# EAGLE design zero_board (EAGLE 9.6.2)
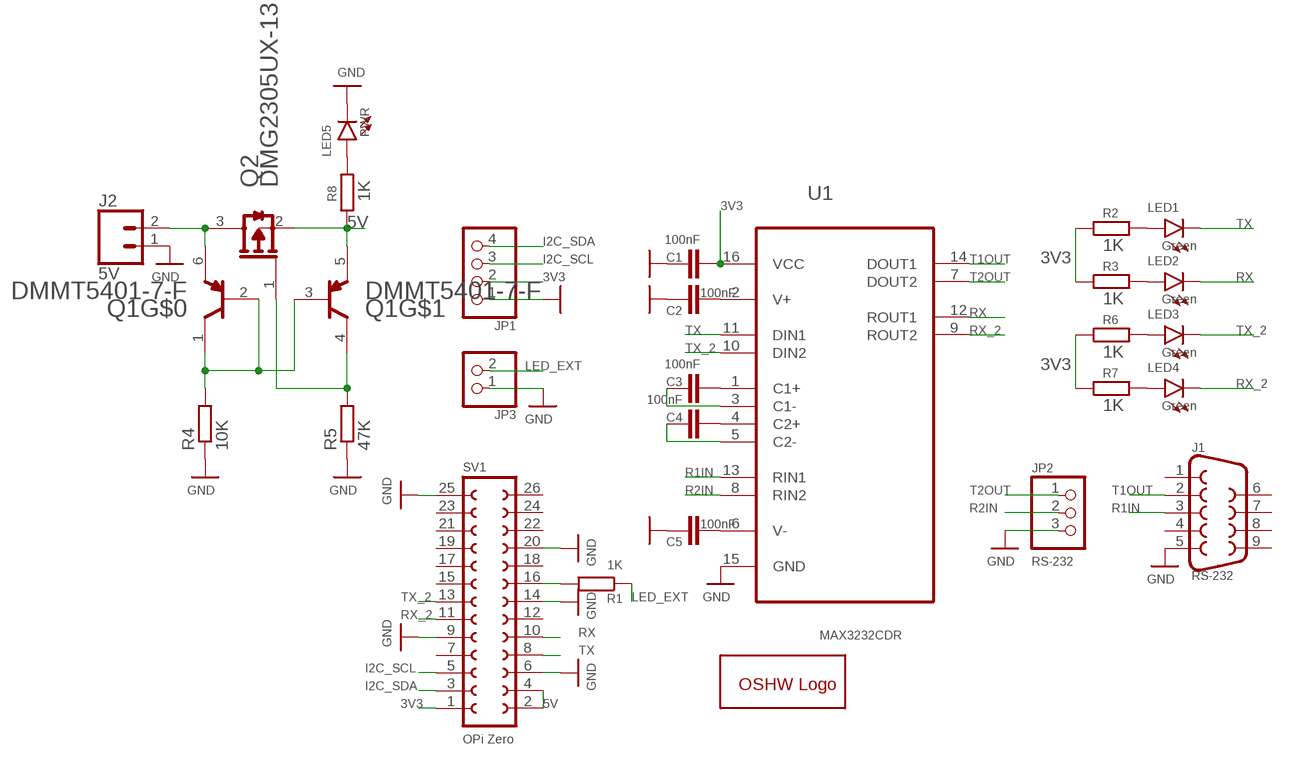
[diagram p0: schematic, sheet 1]

## Parts
C1  100nF  C-EUC0603  [C0603]
C2  100nF  C-EUC0603  [C0603]
C3  100nF  C-EUC0603  [C0603]
C4  100nF  C-EUC0603  [C0603]
C5  100nF  C-EUC0603  [C0603]
GOLD_ORB_SM1  OSHWLOGOLOGO5MM  [OSHW_5MM]
J1  RS-232  DB9FEMALE  [DB9]
J2  5V  CONN_023.5MM  [SCREWTERMINAL-3.5MM-2]
JP1  OLED  PINHD-1X4  [1X04]
JP2  RS-232  PINHD-1X3  [1X03]
JP3  LED  PINHD-1X2  [1X02]
LED1  Green  LEDCHIP-LED0603  [CHIP-LED0603]
LED2  Green  LEDCHIP-LED0603  [CHIP-LED0603]
LED3  Green  LEDCHIP-LED0603  [CHIP-LED0603]
LED4  Green  LEDCHIP-LED0603  [CHIP-LED0603]
LED5  PWR  LEDCHIP-LED0603  [CHIP-LED0603]
Q1  DIODES_DMMT5401-7-FDIODES_DMMT5401-7-F_0_0  [DIODES_DMMT5401-7-F_0]
Q2  DIODES_INC._DMG2305UX-13DIODES_INC._DMG2305UX-13_0_0  [DIODES_INC._DMG2305UX-13_0]
R1  1K  R-EU_R0603  [R0603]
R2  1K  R-EU_R0603  [R0603]
R3  1K  R-EU_R0603  [R0603]
R4  10K  R-EU_R0402  [R0402]
R5  47K  R-EU_R0402  [R0402]
R6  1K  R-EU_R0603  [R0603]
R7  1K  R-EU_R0603  [R0603]
R8  1K  R-EU_R0603  [R0603]
SV1  OPi Zero  FE13-2  [FE13-2]
U1  MAX3232CDR  [SOIC127P600X175-16N]

## Nets
3V3: C1.2 JP1.2 R2.1 R3.1 R6.1 R7.1 SV1.1 U1.16(VCC)
5V: Q1.5(E2) Q2.2(S) R8.1 SV1.2 SV1.4
GND: C1.1 C2.1 C5.1 J1.5 J2.1 JP1.1 JP2.3 JP3.1 LED5.C R4.1 R5.1 SV1.6 SV1.9 SV1.14 SV1.20 SV1.25 U1.15(GND)
I2C_SCL: JP1.3 SV1.5
I2C_SDA: JP1.4 SV1.3
LED_EXT: JP3.2 R1.1
N$1: C4.1 U1.5(C2-)
N$2: C2.2 U1.2(V+)
N$3: C3.1 U1.3(C1-)
N$4: R1.2 SV1.16
N$5: C3.2 U1.1(C1+)
N$6: C4.2 U1.4(C2+)
N$7: C5.2 U1.6(V-)
N$8: LED1.A R2.2
N$9: LED2.A R3.2
N$10: Q1.1(C1) Q1.2(B1) Q1.3(B2) R4.2
N$11: J2.2 Q1.6(E1) Q2.3(D)
N$12: Q1.4(C2) Q2.1(G) R5.2
N$13: LED3.A R6.2
N$14: LED4.A R7.2
N$15: LED5.A R8.2
R1IN: J1.3 U1.13(RIN1)
R2IN: JP2.2 U1.8(RIN2)
RX: LED2.C SV1.10 U1.12(ROUT1)
RX_2: LED4.C SV1.11 U1.9(ROUT2)
T1OUT: J1.2 U1.14(DOUT1)
T2OUT: JP2.1 U1.7(DOUT2)
TX: LED1.C SV1.8 U1.11(DIN1)
TX_2: LED3.C SV1.13 U1.10(DIN2)
Unconnected: J1.1 J1.4 J1.6 J1.7 J1.8 J1.9 SV1.7 SV1.12 SV1.15 SV1.17 SV1.18 SV1.19 SV1.21 SV1.22 SV1.23 SV1.24 SV1.26

## Library data of the parts
C1-C5 = rcl:C-EU: CAPACITOR, European symbol; SPICEPREFIX: C
GOLD_ORB_SM1 = oshw:OSHWLOGO: The OSHW logo for PCB layout
J1 = SparkFun-Connectors:DB9: DB9 Connector Standard DB9 (D-Sub 9) serial connector. Can be used for CAN bus as well as RS485 and RS232. Footprint production proven. Here is the female version connector we sell at SparkFun: 9 Pin Female Serial Connector - PCB Mount <https://www.sparkfun.com/products/429> (PRT-00429) This connector has been used on the following SparkFun products: SparkFun RS232 Shifter - SMD <https://www.sparkfun.com/products/449> (PRT-00449) SparkFun RS232 Shifter SMD (No DB9) <https://www.sparkfun.com/products/8780> (PRT-08780); PROD_ID: CONN-08194
J2 = SparkFun-Connectors:CONN_02: Multi connection point. Often used as Generic Header-pin footprint for 0.1 inch spaced/style header connections On any of the 0.1 inch spaced packages, you can populate with these: Break Away Headers - Straight <https://www.sparkfun.com/products/116> (PRT-00116) Break Away Male Headers - Right Angle <https://www.sparkfun.com/products/553> (PRT-00553) Female Headers <https://www.sparkfun.com/products/115> (PRT-00115) Break Away Headers - Machine Pin <https://www.sparkfun.com/products/117> (PRT-00117) Break Away Female Headers - Swiss Machine Pin <https://www.sparkfun.com/products/743> (PRT-00743) For SCREWTERMINALS and SPRING TERMINALS visit here: Screw Terimnals on SparkFun.com <https://www.sparkfun.com/search/results?term=Screw+Terminals> (5mm/3.5mm/2.54mm spacing) This device is also useful as a general connection point to wire up your design to another part of your project. Our various solder wires solder well into these plated through hole pads. Hook-Up Wire - Assortment (Stranded, 22 AWG) <https://www.sparkfun.com/products/11375> (PRT-11375) Hook-Up Wire - Assortment (Solid Core, 22 AWG) <https://www.sparkfun.com/products/11367> (PRT-11367) View the entire wire category on our website here <https://www.sparkfun.com/categories/141> Special notes: Molex polarized connector foot print use with: PRT-08233 with associated crimp pins and housings. 2.54_SCREWTERM for use with PRT-10571. 3.5mm Screw Terminal footprints for PRT-08084 5mm Screw Terminal footprints for use with PRT-08432; PROD_ID: CONN-08399
JP1 = pinhead:PINHD-1X4: PIN HEADER
JP2 = pinhead:PINHD-1X3: PIN HEADER
JP3 = pinhead:PINHD-1X2: PIN HEADER
LED1-LED5 = led:LED: LED OSRAM: - CHIPLED LG R971, LG N971, LY N971, LG Q971, LY Q971, LO R971, LY R971 LH N974, LH R974 LS Q976, LO Q976, LY Q976 LO Q996 - Hyper CHIPLED LW Q18S LB Q993, LB Q99A, LB R99A - SideLED LS A670, LO A670, LY A670, LG A670, LP A670 LB A673, LV A673, LT A673, LW A673 LH A674 LY A675 LS A676, LA A676, LO A676, LY A676, LW A676 LS A679, LY A679, LG A679 - Hyper Micro SIDELED® LS Y876, LA Y876, LO Y876, LY Y876 LT Y87S - SmartLED LW L88C, LW L88S LB L89C, LB L89S, LG L890 LS L89K, LO L89K, LY L89K LS L896, LA L896, LO L896, LY L896 - TOPLED LS T670, LO T670, LY T670, LG T670, LP T670 LSG T670, LSP T670, LSY T670, LOP T670, LYG T670 LG T671, LOG T671, LSG T671 LB T673, LV T673, LT T673, LW T673 LH T674 LS T676, LA T676, LO T676, LY T676, LB T676, LH T676, LSB T676, LW T676 LB T67C, LV T67C, LT T67C, LS T67K, LO T67K, LY T67K, LW E67C LS E67B, LA E67B, LO E67B, LY E67B, LB E67C, LV E67C, LT E67C LW T67C LS T679, LY T679, LG T679 LS T770, LO T770, LY T770, LG T770, LP T770 LB T773, LV T773, LT T773, LW T773 LH T774 LS E675, LA E675, LY E675, LS T675 LS T776, LA T776, LO T776, LY T776, LB T776 LHGB T686 LT T68C, LB T68C - Hyper Mini TOPLED® LB M676 - Mini TOPLED Santana® LG M470 LS M47K, LO M47K, LY M47K Source: http://www.osram.convergy.de LUXEON: - LUMILED® LXK2-PW12-R00, LXK2-PW12-S00, LXK2-PW14-U00, LXK2-PW14-V00 LXK2-PM12-R00, LXK2-PM12-S00, LXK2-PM14-U00 LXK2-PE12-Q00, LXK2-PE12-R00, LXK2-PE12-S00, LXK2-PE14-T00, LXK2-PE14-U00 LXK2-PB12-K00, LXK2-PB12-L00, LXK2-PB12-M00, LXK2-PB14-N00, LXK2-PB14-P00, LXK2-PB14-Q00 LXK2-PR12-L00, LXK2-PR12-M00, LXK2-PR14-Q00, LXK2-PR14-R00 LXK2-PD12-Q00, LXK2-PD12-R00, LXK2-PD12-S00 LXK2-PH12-R00, LXK2-PH12-S00 LXK2-PL12-P00, LXK2-PL12-Q00, LXK2-PL12-R00 Source: www.luxeon.com KINGBRIGHT: KA-3528ASYC Source: www.kingbright.com
Q1 = Diodes - DMMT5401-7-F:DIODES_DMMT5401-7-F: Bipolar (BJT) Transistor Array 2 PNP (Dual) Matched Pair 150V 200mA 300MHz 300mW Surface Mount SOT-26; AUTOMOTIVE: Yes; AUTOMOTIVE_GRADE: Grade 0; CENTROID_NOT_SPECIFIED: No; CIIVA_IDS: 854262; COLLECTOR_BASE_VOLTAGE: -160V; COLLECTOR_EMITTER_BREAKDOWN_VOLTAGE: -150V; COLLECTOR_EMITTER_SATURATION_VOLTAGE: -0.5V; COLLECTOR_EMITTER_VOLTAGE: -150V; DATASHEET: https://www.diodes.com/assets/Datasheets/ds30437.pdf; DEVICE_CLASS_L1: Discrete Semiconductors; DEVICE_CLASS_L2: Transistors; DEVICE_CLASS_L3: BJTs; DIGIKEY_DESCRIPTION: TRANS 2PNP 150V 0.2A SOT26; DIGIKEY_PART_NUMBER: DMMT5401-FDICT-ND; EMITTER_BASE_VOLTAGE: -5V; FOOTPRINT_PARAMETERS_1: {"fp_type":"SOT23","params":{"N":{"default":"6","long name":"Number of leads","type":"multichoice","short name":"N"},"A":{"nom":1150000,"long name":"Height","min":1012999,"max":1400000,"short name":"A","type":"measurement"},"A1":{"nom":50000,"long name":"Package clearance","min":13000,"max":100000,"short name":"A1","type":"measurement"},"A2":{"nom":1100000,"long name":"Package height","min":1000000,"max":1300000,"short name":"A2","type":"measurement"},"D":{"nom":3000000,"long name":"Package length","min":2900000,"max":3100000,"short name":"D","type":"measurement"},"E":{"nom":2800000,"long name":"Width /w leads","min":2700000,"max":3000000,"short name":"E","type":"measurement"},"E1":{"nom":1600000,"long name":"Package width","min":1500000,"max":1700000,"short name":"E1","type":"measurement"},"B":{"nom":380000,"long name":"Lead width","min":350000,"max":500000,"short name":"B","type":"measurement"},"C":{"nom":150000,"long name":"Lead thickness","min":100000,"max":200000,"short name":"C","type":"measurement"},"L":{"nom":400000,"long name":"Lead foot length","min":350000,"max":550000,"short name":"L","type":"measurement"},"e":{"nom":950000,"long name":"Lead pitch","min":null,"max":null,"short name":"e","type":"measurement"},"PHI":{"nom":false,"long name":"Lead angle","min":0,"max":8000000,"short name":"PHI","type":"measurement"},"offset x":{"nom":0,"long name":"X Center offset","min":null,"max":null,"short name":"offset x","type":"measurement"},"offset y":{"nom":0,"long name":"Y Center offset","min":null,"max":null,"short name":"offset y","type":"measurement"},"LS":{"default":"Rounded rectangle","long name":"Land shape","type":"multichoice","short name":"LS"},"LS1":{"default":"Rectangle","long name":"Land shape (Pin 1)","type":"multichoice","short name":"LS1"},"solder toe":{"nom":550000,"long name":"Solder fillet (toe)","min":null,"max":null,"short name":"solder toe","type":"fixedmeasurement"},"solder heel":{"nom":450000,"long name":"Solder fillet (heel)","min":null,"max":null,"short name":"solder heel","type":"fixedmeasurement"},"solder side":{"nom":50000,"long name":"Solder fillet (side)","min":null,"max":null,"short name":"solder side","type":"fixedmeasurement"},"courtyard":{"nom":500000,"long name":"Courtyard","min":null,"max":null,"short name":"courtyard","type":"fixedmeasurement"},"SF":{"default":"A","long name":"Packing level","type":"multichoiceparent","short name":"SF","help":"http://support.upverter.com/customer/portal/articles/978783-what-is-a-footprint-packing-level","children":["solder toe","solder heel","solder side","courtyard"]}}}; FOOTPRINT_PARAMETERS_2: {"fp_type":"SOT23","params":{"N":{"default":"6","long name":"Number of leads","type":"multichoice","short name":"N"},"A":{"nom":1150000,"long name":"Height","min":1012999,"max":1400000,"short name":"A","type":"measurement"},"A1":{"nom":50000,"long name":"Package clearance","min":13000,"max":100000,"short name":"A1","type":"measurement"},"A2":{"nom":1100000,"long name":"Package height","min":1000000,"max":1300000,"short name":"A2","type":"measurement"},"D":{"nom":3000000,"long name":"Package length","min":2900000,"max":3100000,"short name":"D","type":"measurement"},"E":{"nom":2800000,"long name":"Width /w leads","min":2700000,"max":3000000,"short name":"E","type":"measurement"},"E1":{"nom":1600000,"long name":"Package width","min":1500000,"max":1700000,"short name":"E1","type":"measurement"},"B":{"nom":380000,"long name":"Lead width","min":350000,"max":500000,"short name":"B","type":"measurement"},"C":{"nom":150000,"long name":"Lead thickness","min":100000,"max":200000,"short name":"C","type":"measurement"},"L":{"nom":400000,"long name":"Lead foot length","min":350000,"max":550000,"short name":"L","type":"measurement"},"e":{"nom":950000,"long name":"Lead pitch","min":null,"max":null,"short name":"e","type":"measurement"},"PHI":{"nom":false,"long name":"Lead angle","min":0,"max":8000000,"short name":"PHI","type":"measurement"},"offset x":{"nom":0,"long name":"X Center offset","min":null,"max":null,"short name":"offset x","type":"measurement"},"offset y":{"nom":0,"long name":"Y Center offset","min":null,"max":null,"short name":"offset y","type":"measurement"},"LS":{"default":"Rounded rectangle","long name":"Land shape","type":"multichoice","short name":"LS"},"LS1":{"default":"Rectangle","long name":"Land shape (Pin 1)","type":"multichoice","short name":"LS1"},"solder toe":{"nom":350000,"long name":"Solder fillet (toe)","min":null,"max":null,"short name":"solder toe","type":"fixedmeasurement"},"solder heel":{"nom":350000,"long name":"Solder fillet (heel)","min":null,"max":null,"short name":"solder heel","type":"fixedmeasurement"},"solder side":{"nom":30000,"long name":"Solder fillet (side)","min":null,"max":null,"short name":"solder side","type":"fixedmeasurement"},"courtyard":{"nom":250000,"long name":"Courtyard","min":null,"max":null,"short name":"courtyard","type":"fixedmeasurement"},"SF":{"default":"B","long name":"Packing level","type":"multichoiceparent","short name":"SF","help":"http://support.upverter.com/customer/portal/articles/978783-what-is-a-footprint-packing-level","children":["solder toe","solder heel","solder side","courtyard"]}}}; FOOTPRINT_PARAMETERS_3: {"fp_type":"SOT23","params":{"N":{"default":"6","long name":"Number of leads","type":"multichoice","short name":"N"},"A":{"nom":1150000,"long name":"Height","min":1012999,"max":1400000,"short name":"A","type":"measurement"},"A1":{"nom":50000,"long name":"Package clearance","min":13000,"max":100000,"short name":"A1","type":"measurement"},"A2":{"nom":1100000,"long name":"Package height","min":1000000,"max":1300000,"short name":"A2","type":"measurement"},"D":{"nom":3000000,"long name":"Package length","min":2900000,"max":3100000,"short name":"D","type":"measurement"},"E":{"nom":2800000,"long name":"Width /w leads","min":2700000,"max":3000000,"short name":"E","type":"measurement"},"E1":{"nom":1600000,"long name":"Package width","min":1500000,"max":1700000,"short name":"E1","type":"measurement"},"B":{"nom":380000,"long name":"Lead width","min":350000,"max":500000,"short name":"B","type":"measurement"},"C":{"nom":150000,"long name":"Lead thickness","min":100000,"max":200000,"short name":"C","type":"measurement"},"L":{"nom":400000,"long name":"Lead foot length","min":350000,"max":550000,"short name":"L","type":"measurement"},"e":{"nom":950000,"long name":"Lead pitch","min":null,"max":null,"short name":"e","type":"measurement"},"PHI":{"nom":false,"long name":"Lead angle","min":0,"max":8000000,"short name":"PHI","type":"measurement"},"offset x":{"nom":0,"long name":"X Center offset","min":null,"max":null,"short name":"offset x","type":"measurement"},"offset y":{"nom":0,"long name":"Y Center offset","min":null,"max":null,"short name":"offset y","type":"measurement"},"LS":{"default":"Rounded rectangle","long name":"Land shape","type":"multichoice","short name":"LS"},"LS1":{"default":"Rectangle","long name":"Land shape (Pin 1)","type":"multichoice","short name":"LS1"},"solder toe":{"nom":150000,"long name":"Solder fillet (toe)","min":null,"max":null,"short name":"solder toe","type":"fixedmeasurement"},"solder heel":{"nom":250000,"long name":"Solder fillet (heel)","min":null,"max":null,"short name":"solder heel","type":"fixedmeasurement"},"solder side":{"nom":10000,"long name":"Solder fillet (side)","min":null,"max":null,"short name":"solder side","type":"fixedmeasurement"},"courtyard":{"nom":100000,"long name":"Courtyard","min":null,"max":null,"short name":"courtyard","type":"fixedmeasurement"},"SF":{"default":"C","long name":"Packing level","type":"multichoiceparent","short name":"SF","help":"http://support.upverter.com/customer/portal/articles/978783-what-is-a-footprint-packing-level","children":["solder toe","solder heel","solder side","courtyard"]}}}; FOOTPRINT_URL: https://www.diodes.com/assets/Package-Files/SOT26-SC74R.pdf; FOOTPRINT_VARIANT_NAME_0: Recommended_Land_Pattern; FOOTPRINT_VARIANT_NAME_1: IPC_A; FOOTPRINT_VARIANT_NAME_2: IPC_B; FOOTPRINT_VARIANT_NAME_3: IPC_C; GAIN_BANDWIDTH_PRODUCT: 100MHz; HEIGHT: 1.4mm; HFE_MAX: 240; HFE_MIN: 60; HFE_SS_MAX: 260; HFE_SS_MIN: 40; HFE_SS_TESTIC: -1mA; HFE_SS_TESTVCE: -10V; HFE_TESTIC: -10mA; HFE_TESTVCE: -5V; IMPORTED_FROM: vault; IMPORT_TS: 1521857859; LEAD_FREE: Yes; MAX_COLLECTOR_CURRENT: -200mA; MAX_JUNCTION_TEMP: +150°C; MF: Diodes; MFG_PACKAGE_IDENT: SOT26 (SC74R); MFG_PACKAGE_IDENT_COMPONENT_ID: 5f0f242ef940d63b; MFG_PACKAGE_IDENT_DATE: 03/2017; MFG_PACKAGE_IDENT_REV: 0; MOUSER_DESCRIPTION: Bipolar Transistors - BJT MATCHED PNP SM SIGNAL TRANS; MOUSER_PART_NUMBER: 621-DMMT5401-7-F; MPN: DMMT5401-7-F; NUMBER_OF_ELEMENTS: 2; NUMBER_OF_PNP: 2; PACKAGE: SOT-26-6; POWER_DISSIPATION: 300mW; PREFIX: Q; RELEASE_DATE: 1475030218; RESISTANCE: 56.2 kohm; ROHS: Yes; RTHJA_MAX: 417°C/W; STANDOFF_HEIGHT: 0.013mm; TEMPERATURE_RANGE_HIGH: +150°C; TEMPERATURE_RANGE_LOW: -55°C; VAULT_GUID: AAD9F767-3884-4A64-86E0-FF641185CA98; VERIFICATION_VERSION: 0.0.0.3
Q2 = Diodes Inc. - DMG2305UX-13:DIODES_INC._DMG2305UX-13: P-Channel 20V 4.2A (Ta) 1.4W (Ta) Surface Mount SOT-23; AUTOMOTIVE: No; CENTROID_NOT_SPECIFIED: No; CONTINUOUS_DRAIN_CURRENT: -4.2A; DATASHEET: https://www.diodes.com/assets/Datasheets/DMG2305UX.pdf; DEPLETION_MODE: False; DEVICE_CLASS_L1: Discrete Semiconductors; DEVICE_CLASS_L2: Transistors; DEVICE_CLASS_L3: MOSFETs; DIGIKEY_DESCRIPTION: TRANS MOSFET P-CH 20V 4.2A SOT23; DIGIKEY_PART_NUMBER: DMG2305UX-13DICT-ND; DRAIN_TO_SOURCE_BREAKDOWN_VOLTAGE: -20V; DRAIN_TO_SOURCE_RESISTANCE: 40mΩ; DRAIN_TO_SOURCE_VOLTAGE: -20V; FOOTPRINT_PARAMETERS_1: {"fp_type":"SOT23","params":{"N":{"default":"3","long name":"Number of leads","type":"multichoice","short name":"N"},"A":{"nom":1024999,"long name":"Height","min":903000,"max":1100000,"short name":"A","type":"measurement"},"A1":{"nom":50000,"long name":"Package clearance","min":13000,"max":100000,"short name":"A1","type":"measurement"},"A2":{"nom":975000,"long name":"Package height","min":890000,"max":1000000,"short name":"A2","type":"measurement"},"D":{"nom":2900000,"long name":"Package length","min":2800000,"max":3000000,"short name":"D","type":"measurement"},"E":{"nom":2400000,"long name":"Width /w leads","min":2300000,"max":2500000,"short name":"E","type":"measurement"},"E1":{"nom":1300000,"long name":"Package width","min":1200000,"max":1400000,"short name":"E1","type":"measurement"},"B":{"nom":400000,"long name":"Lead width","min":370000,"max":510000,"short name":"B","type":"measurement"},"C":{"nom":110000,"long name":"Lead thickness","min":85000,"max":150000,"short name":"C","type":"measurement"},"L":{"nom":400000,"long name":"Lead foot length","min":250000,"max":550000,"short name":"L","type":"measurement"},"e":{"nom":915000,"long name":"Lead pitch","min":null,"max":null,"short name":"e","type":"measurement"},"PHI":{"nom":false,"long name":"Lead angle","min":0,"max":8000000,"short name":"PHI","type":"measurement"},"offset x":{"nom":0,"long name":"X Center offset","min":null,"max":null,"short name":"offset x","type":"measurement"},"offset y":{"nom":0,"long name":"Y Center offset","min":null,"max":null,"short name":"offset y","type":"measurement"},"LS":{"default":"Rounded rectangle","long name":"Land shape","type":"multichoice","short name":"LS"},"LS1":{"default":"Rectangle","long name":"Land shape (Pin 1)","type":"multichoice","short name":"LS1"},"solder toe":{"nom":550000,"long name":"Solder fillet (toe)","min":null,"max":null,"short name":"solder toe","type":"fixedmeasurement"},"solder heel":{"nom":450000,"long name":"Solder fillet (heel)","min":null,"max":null,"short name":"solder heel","type":"fixedmeasurement"},"solder side":{"nom":50000,"long name":"Solder fillet (side)","min":null,"max":null,"short name":"solder side","type":"fixedmeasurement"},"courtyard":{"nom":500000,"long name":"Courtyard","min":null,"max":null,"short name":"courtyard","type":"fixedmeasurement"},"SF":{"default":"A","long name":"Packing level","type":"multichoiceparent","short name":"SF","help":"http://support.upverter.com/customer/portal/articles/978783-what-is-a-footprint-packing-level","children":["solder toe","solder heel","solder side","courtyard"]}}}; FOOTPRINT_PARAMETERS_2: {"fp_type":"SOT23","params":{"N":{"default":"3","long name":"Number of leads","type":"multichoice","short name":"N"},"A":{"nom":1024999,"long name":"Height","min":903000,"max":1100000,"short name":"A","type":"measurement"},"A1":{"nom":50000,"long name":"Package clearance","min":13000,"max":100000,"short name":"A1","type":"measurement"},"A2":{"nom":975000,"long name":"Package height","min":890000,"max":1000000,"short name":"A2","type":"measurement"},"D":{"nom":2900000,"long name":"Package length","min":2800000,"max":3000000,"short name":"D","type":"measurement"},"E":{"nom":2400000,"long name":"Width /w leads","min":2300000,"max":2500000,"short name":"E","type":"measurement"},"E1":{"nom":1300000,"long name":"Package width","min":1200000,"max":1400000,"short name":"E1","type":"measurement"},"B":{"nom":400000,"long name":"Lead width","min":370000,"max":510000,"short name":"B","type":"measurement"},"C":{"nom":110000,"long name":"Lead thickness","min":85000,"max":150000,"short name":"C","type":"measurement"},"L":{"nom":400000,"long name":"Lead foot length","min":250000,"max":550000,"short name":"L","type":"measurement"},"e":{"nom":915000,"long name":"Lead pitch","min":null,"max":null,"short name":"e","type":"measurement"},"PHI":{"nom":false,"long name":"Lead angle","min":0,"max":8000000,"short name":"PHI","type":"measurement"},"offset x":{"nom":0,"long name":"X Center offset","min":null,"max":null,"short name":"offset x","type":"measurement"},"offset y":{"nom":0,"long name":"Y Center offset","min":null,"max":null,"short name":"offset y","type":"measurement"},"LS":{"default":"Rounded rectangle","long name":"Land shape","type":"multichoice","short name":"LS"},"LS1":{"default":"Rectangle","long name":"Land shape (Pin 1)","type":"multichoice","short name":"LS1"},"solder toe":{"nom":350000,"long name":"Solder fillet (toe)","min":null,"max":null,"short name":"solder toe","type":"fixedmeasurement"},"solder heel":{"nom":350000,"long name":"Solder fillet (heel)","min":null,"max":null,"short name":"solder heel","type":"fixedmeasurement"},"solder side":{"nom":30000,"long name":"Solder fillet (side)","min":null,"max":null,"short name":"solder side","type":"fixedmeasurement"},"courtyard":{"nom":250000,"long name":"Courtyard","min":null,"max":null,"short name":"courtyard","type":"fixedmeasurement"},"SF":{"default":"B","long name":"Packing level","type":"multichoiceparent","short name":"SF","help":"http://support.upverter.com/customer/portal/articles/978783-what-is-a-footprint-packing-level","children":["solder toe","solder heel","solder side","courtyard"]}}}; FOOTPRINT_PARAMETERS_3: {"fp_type":"SOT23","params":{"N":{"default":"3","long name":"Number of leads","type":"multichoice","short name":"N"},"A":{"nom":1024999,"long name":"Height","min":903000,"max":1100000,"short name":"A","type":"measurement"},"A1":{"nom":50000,"long name":"Package clearance","min":13000,"max":100000,"short name":"A1","type":"measurement"},"A2":{"nom":975000,"long name":"Package height","min":890000,"max":1000000,"short name":"A2","type":"measurement"},"D":{"nom":2900000,"long name":"Package length","min":2800000,"max":3000000,"short name":"D","type":"measurement"},"E":{"nom":2400000,"long name":"Width /w leads","min":2300000,"max":2500000,"short name":"E","type":"measurement"},"E1":{"nom":1300000,"long name":"Package width","min":1200000,"max":1400000,"short name":"E1","type":"measurement"},"B":{"nom":400000,"long name":"Lead width","min":370000,"max":510000,"short name":"B","type":"measurement"},"C":{"nom":110000,"long name":"Lead thickness","min":85000,"max":150000,"short name":"C","type":"measurement"},"L":{"nom":400000,"long name":"Lead foot length","min":250000,"max":550000,"short name":"L","type":"measurement"},"e":{"nom":915000,"long name":"Lead pitch","min":null,"max":null,"short name":"e","type":"measurement"},"PHI":{"nom":false,"long name":"Lead angle","min":0,"max":8000000,"short name":"PHI","type":"measurement"},"offset x":{"nom":0,"long name":"X Center offset","min":null,"max":null,"short name":"offset x","type":"measurement"},"offset y":{"nom":0,"long name":"Y Center offset","min":null,"max":null,"short name":"offset y","type":"measurement"},"LS":{"default":"Rounded rectangle","long name":"Land shape","type":"multichoice","short name":"LS"},"LS1":{"default":"Rectangle","long name":"Land shape (Pin 1)","type":"multichoice","short name":"LS1"},"solder toe":{"nom":150000,"long name":"Solder fillet (toe)","min":null,"max":null,"short name":"solder toe","type":"fixedmeasurement"},"solder heel":{"nom":250000,"long name":"Solder fillet (heel)","min":null,"max":null,"short name":"solder heel","type":"fixedmeasurement"},"solder side":{"nom":10000,"long name":"Solder fillet (side)","min":null,"max":null,"short name":"solder side","type":"fixedmeasurement"},"courtyard":{"nom":100000,"long name":"Courtyard","min":null,"max":null,"short name":"courtyard","type":"fixedmeasurement"},"SF":{"default":"C","long name":"Packing level","type":"multichoiceparent","short name":"SF","help":"http://support.upverter.com/customer/portal/articles/978783-what-is-a-footprint-packing-level","children":["solder toe","solder heel","solder side","courtyard"]}}}; FOOTPRINT_URL: https://www.diodes.com/assets/Package-Files/SOT23.pdf; FOOTPRINT_VARIANT_NAME_0: Recommended_Land_Pattern; FOOTPRINT_VARIANT_NAME_1: IPC_A; FOOTPRINT_VARIANT_NAME_2: IPC_B; FOOTPRINT_VARIANT_NAME_3: IPC_C; GATE_CHARGE_AT_VGS: 10.2nC @ -4.5V; GATE_TO_SOURCE_VOLTAGE: 8V; HEIGHT: 1.1mm; INPUT_CAPACITACE_AT_VDS: 808pF @ -15V; IPC_LAND_PATTERN_NAME: SOT92P240X102-3; LEAD_FREE: Yes; MAX_JUNCTION_TEMP: +150°C; MF: Diodes Inc.; MFG_PACKAGE_IDENT: SOT23; MFG_PACKAGE_IDENT_DATE: 01/2017; MFG_PACKAGE_IDENT_REV: 0; MOUSER_DESCRIPTION: MOSFET P-Ch ENH FET -20V 52mOhm -5.0V; MOUSER_PART_NUMBER: 621-DMG2305UX-13; MPN: DMG2305UX-13; NUMBER_OF_CHANNELS: 1; NUMBER_OF_P_CHANNELS: 1; PACKAGE: SOT23; POWER_DISSIPATION: 1.4W; PREFIX: Q; PULSE_DRAIN_CURRENT: -15A; ROHS: Yes; RTHJA_MAX: 90°C/W; STANDOFF_HEIGHT: 0.013mm; TEMPERATURE_RANGE_HIGH: +150°C; TEMPERATURE_RANGE_LOW: -55°C; THRESHOLD_VGS_MAX: -0.9V; THRESHOLD_VGS_MIN: -0.5V; TURN_OFF_DELAY_TIME: 79.3ns; TURN_ON_DELAY_TIME: 10.8ns; VERIFICATION_VERSION: 0.0.0.3
R1 = rcl:R-EU_: RESISTOR, European symbol
R2 R3 R6-R8 = resistor:R-EU_: RESISTOR, European symbol
R4 R5 = rcl:R-EU_: RESISTOR, European symbol; SPICEPREFIX: R
SV1 = con-lsta:FE13-2: FEMALE HEADER; OC_FARNELL: unknown; OC_NEWARK: unknown
U1 = Texas Instruments_By_element14:MAX3232CDR: Multi Channel RS-232 Line Driver/Recevier; MPN: MAX3232CDR; OC_FARNELL: 1564957; OC_NEWARK: 35K4720; PACKAGE: SOIC-16; SUPPLIER: TEXAS INSTRUMENTS

## Board
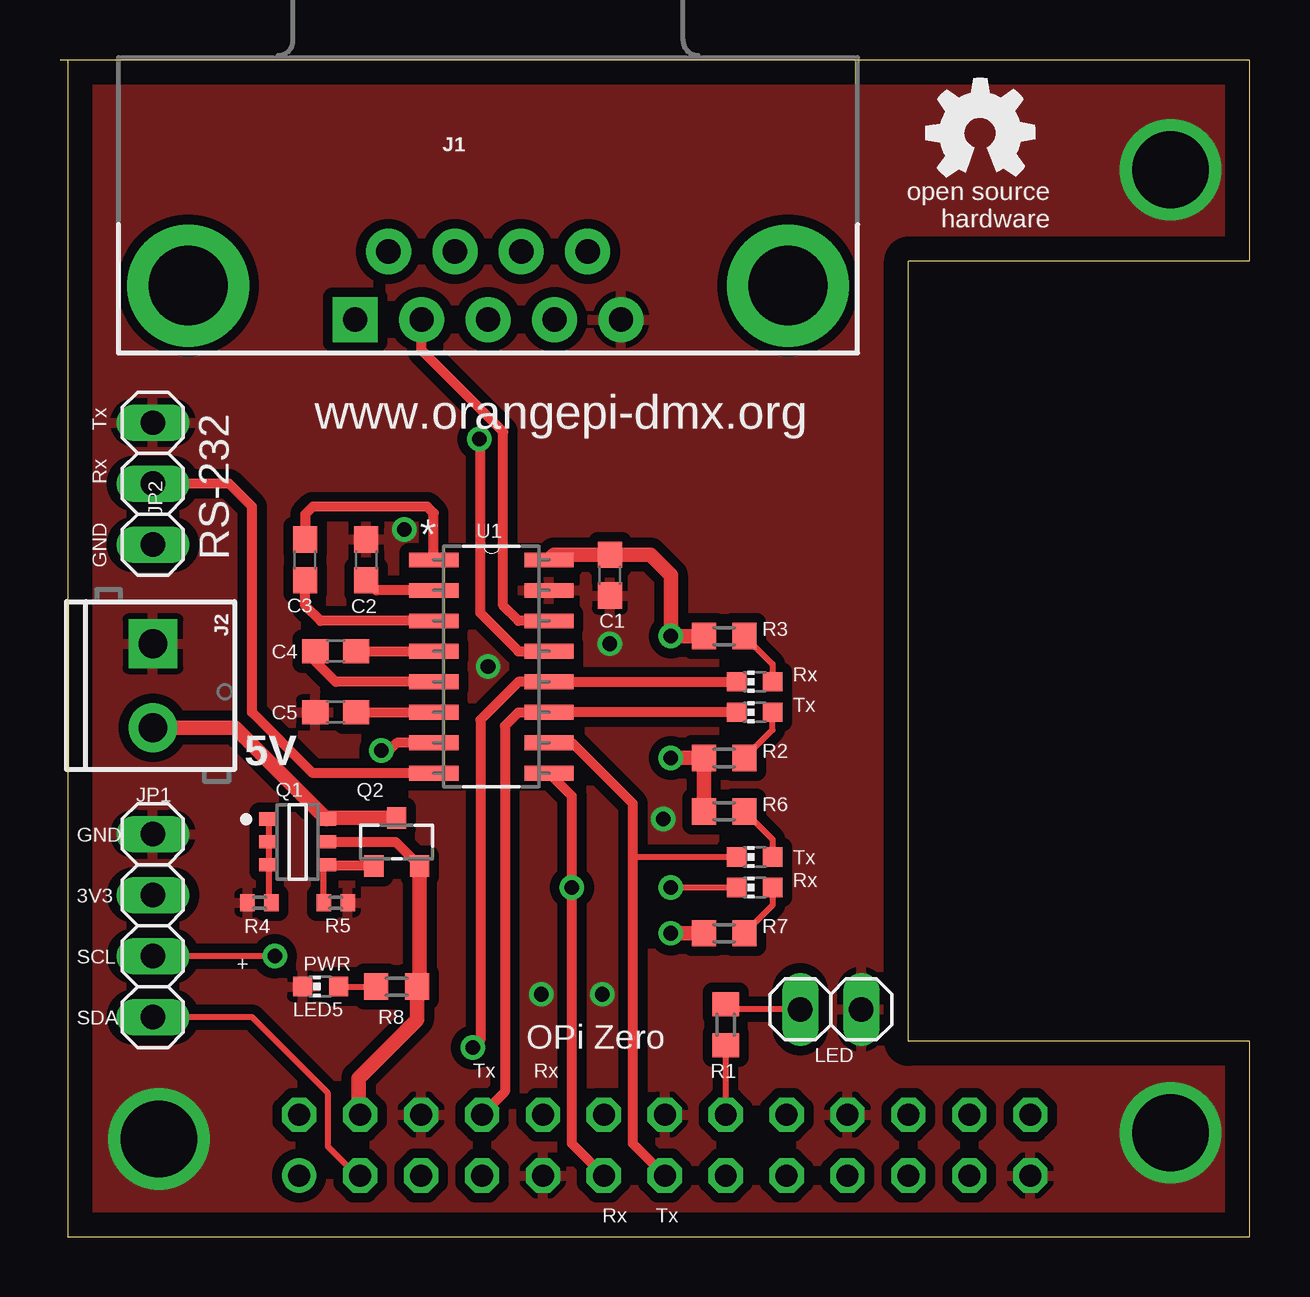
[diagram p1: board, top side]
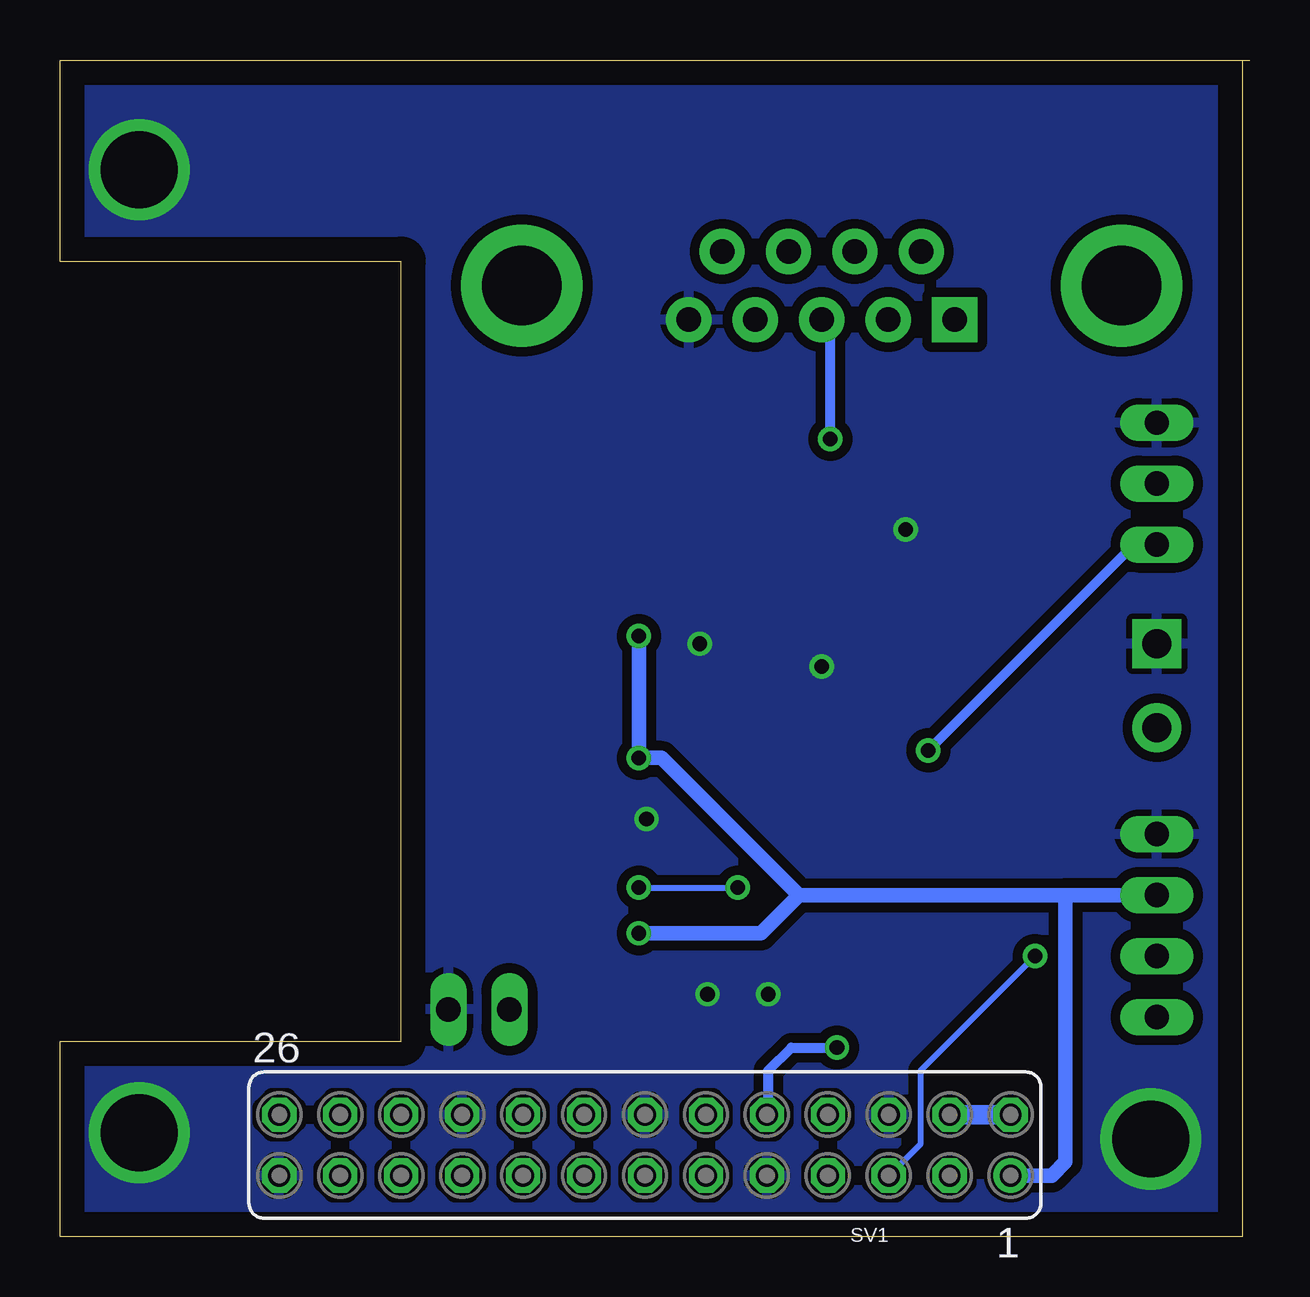
[diagram p2: board, bottom side, seen from below]

Size 49.59 x 49.02 mm. Coordinates in mm from the lower left corner, seen from the top.
Outline: 0.32,49.01 0.32,0 49.59,0 49.59,8.13 35.37,8.13 35.37,40.64 49.59,40.64 49.59,49.02 0,49.02
Copper layers (1*16): Top 0.035mm / dielectric 1.5mm / Bottom 0.035mm
Design rules "default": minimum track width 10mil, minimum drill 24mil, track to track 8mil, track to pad 8mil, pad to pad 8mil, via to via 8mil, smd to smd 8mil, copper to edge 40mil, drill to drill 8mil, minimum pad ring 10mil, minimum via ring 8mil, stop-mask expansion 4mil, vias tented up to drill 0mil, thermal gap 10mil

### Footprints (pad centres in the part's own frame; a part is rotated, then mirrored left to right if it is on the bottom)
C0603 = smd 1.1 x 1: 1 -0.85,0; 2 0.85,0
DB9 = drill 1.016 pad 1.88 square: 1 -5.54,-1.42 | drill 1.016 pad 1.88: 2 -2.77,-1.42; 3 0,-1.42; 4 2.77,-1.42; 5 5.54,-1.42; 6 -4.15,1.42; 7 -1.38,1.42; 8 1.38,1.42; 9 4.15,1.42 | drill 3.302 pad 5.08: G1 -12.5,0; G2 12.5,0
SCREWTERMINAL-3.5MM-2 = drill 1.2 pad 2.032 square: 1 0,0 | drill 1.2 pad 2.032: 2 3.5,0
1X04 = drill 1.016 long: 1 -3.81,0; 2 -1.27,0; 3 1.27,0; 4 3.81,0
1X03 = drill 1.016 long: 1 -2.54,0; 2 0,0; 3 2.54,0
1X02 = drill 1.016 long: 1 -1.27,0; 2 1.27,0
CHIP-LED0603 = smd 0.8 x 0.8: A 0,-0.75; C 0,0.75
DIODES_DMMT5401-7-F_0 = smd 0.8 x 0.55: 1 -1.2,0.95; 2 -1.2,0; 3 -1.2,-0.95; 4 1.2,-0.95; 5 1.2,0; 6 1.2,0.95
DIODES_INC._DMG2305UX-13_0 = smd 0.9 x 0.8: 1 -1,0.95; 2 -1,-0.95; 3 1,0
R0603 = smd 1 x 1.1: 1 -0.85,0; 2 0.85,0
R0402 = smd 0.6 x 0.7: 1 -0.5,0; 2 0.5,0
FE13-2 = drill 0.914: 1 -15.24,1.27 | drill 0.914 octagon: 2 -15.24,-1.27; 3 -12.7,1.27; 4 -12.7,-1.27; 5 -10.16,1.27; 6 -10.16,-1.27; 7 -7.62,1.27; 8 -7.62,-1.27; 9 -5.08,1.27; 10 -5.08,-1.27; 11 -2.54,1.27; 12 -2.54,-1.27; 13 0,1.27; 14 0,-1.27; 15 2.54,1.27; 16 2.54,-1.27; 17 5.08,1.27; 18 5.08,-1.27; 19 7.62,1.27; 20 7.62,-1.27; 21 10.16,1.27; 22 10.16,-1.27; 23 12.7,1.27; 24 12.7,-1.27; 25 15.24,1.27; 26 15.24,-1.27
SOIC127P600X175-16N = smd 2.057 x 0.61: 1 -4.801,8.89; 2 -4.801,7.62; 3 -4.801,6.35; 4 -4.801,5.08; 5 -4.801,3.81; 6 -4.801,2.54; 7 -4.801,1.27; 8 -4.801,0; 9 0,0; 10 0,1.27; 11 0,2.54; 12 0,3.81; 13 0,5.08; 14 0,6.35; 15 0,7.62; 16 0,8.89

### Placement (x,y rotation side)
C1  22.92,27.56 90 top
C2  12.76,28.19 270 top
C3  10.22,28.19 90 top
C4  11.49,24.38 0 top
C5  11.49,21.84 0 top
GOLD_ORB_SM1  38.35,45.97 0 top
J1  17.84,39.62 0 top
J2  3.87,24.7 270 top
JP1  3.87,12.95 270 top
JP2  3.87,31.37 90 top
JP3  32.13,9.46 180 top
LED1  28.96,21.84 90 top
LED2  28.96,23.11 90 top
LED3  28.96,15.81 90 top
LED4  28.96,14.54 90 top
LED5  10.86,10.41 90 top
Q1  9.91,16.45 0 top
Q2  14.03,16.45 90 top
R1  27.75,8.83 270 top
R2  27.69,19.94 0 top
R3  27.69,25.02 0 top
R4  8.32,13.91 0 top
R5  11.49,13.91 180 top
R6  27.69,17.72 0 top
R7  27.69,12.64 0 top
R8  14.03,10.41 180 top
SV1  25.21,3.81 180 bottom
U1  20.38,19.3 0 top

### Tracks (layer width: path | path; a pad name or v marks a point on that pad's centre or on a via)
3V3  (via drill 0.61)
  Top 0.61: U1.16 20.6,28.41 C1.2 24.61,28.41 25.46,27.56 v25.46,25.02 R3.1 | v25.46,19.94 R2.1 R6.1 | R7.1 v25.46,12.64
  Bottom 0.61: v25.46,25.02 v25.46,19.94 24.51,19.94 18.8,14.22 | 18.8,14.22 7.68,14.22 | 7.68,14.22 7.68,3.11 8.25,2.54 SV1.1 | JP1.2 7.68,14.22 | v25.46,12.64 20.38,12.64 18.8,14.22
5V
  Top 0.406: Q1.5 13.98,16.45 Q2.2
  Top 0.61: Q2.2 14.98,10.51 R8.1 14.88,9.04 12.45,6.6 12.45,5.14 SV1.4
  Bottom 0.813: SV1.4 SV1.2
GND  (via drill 0.61, 3.2)
  other vias: 4.13,4.06 46.29,4.32 46.29,44.45 14.35,29.46 20.07,10.1 22.61,10.1 17.84,23.75 22.92,24.7 25.15,17.4
  pour Bottom (isolate 0.406): 49.59,0 0.06,0 0.06,49.28 49.59,49.28 49.59,40.64 35.37,40.64 35.37,8.13 49.59,8.13
  pour Top (isolate 0.406): 49.59,0 49.59,8.13 35.37,8.13 35.37,40.64 49.59,40.64 49.59,49.28 0.06,49.28 0.06,0
I2C_SCL  (via drill 0.61)
  Top 0.254: v8.95,11.68 JP1.3
  Bottom 0.254: SV1.5 13.72,3.87 13.72,6.92 v8.95,11.68
I2C_SDA
  Top 0.254: SV1.3 12.38,2.54 11.18,3.75 11.18,5.97 8,9.14 JP1.4
LED_EXT
  Top 0.254: JP3.2 27.96,9.46 R1.1
N$1
  Top 0.406: U1.5 11.49,23.11 10.64,23.96 C4.1
N$2
  Top 0.406: U1.2 13.18,26.92 C2.2
N$3
  Top 0.406: U1.3 10.86,25.65 10.22,26.29 C3.1
N$4
  Top 0.254: R1.2 SV1.16
N$5
  Top 0.254: 10.22,29.46 10.22,29.15 C3.2
  Top 0.406: U1.1 15.58,30.14 15.3,30.42 10.54,30.42 10.22,30.1 10.22,29.46
N$6
  Top 0.406: C4.2 U1.4
N$7
  Top 0.406: C5.2 U1.6
N$8
  Top 0.254: R2.2 29.71,21.11 LED1.A
N$9
  Top 0.254: R3.2 29.71,23.85 LED2.A
N$10
  Top 0.254: Q1.1 Q1.2 Q1.3 8.71,14.02 R4.2
N$11
  Top 0.61: J2.2 7.3,21.2 Q1.6 11.16,17.45 Q2.3
N$12
  Top 0.254: R5.2 10.99,15.38 Q1.4
  Top 0.406: Q2.1 11.16,15.45 Q1.4
N$13
  Top 0.254: R6.2 29.71,16.55 LED3.A
N$14
  Top 0.254: LED4.A 29.71,13.81 R7.2
N$15
  Top 0.254: LED5.A R8.2
R1IN  (via drill 0.61)
  Top 0.406: U1.13 19.11,24.38 17.53,25.97 17.53,33.19 v17.48,33.23
  Bottom 0.406: v17.48,33.23 17.48,37.84 J1.3
R2IN
  Top 0.406: U1.8 10.54,19.3 8,21.84 8,30.42 7.05,31.37 JP2.2
RX  (via drill 0.61)
  Top 0.406: LED2.C U1.12 19.11,23.11 17.53,21.53 17.53,8.19 v17.21,7.87
  Bottom 0.406: SV1.10 20.07,5.14 20.07,6.92 19.11,7.87 v17.21,7.87
RX_2  (via drill 0.61)
  Top 0.254: LED4.C v25.46,14.54
  Top 0.406: SV1.11 21.34,3.87 21.34,13.91 v21.34,14.54 21.34,18.35 U1.9
  Bottom 0.254: v25.46,14.54 v21.34,14.54
T1OUT
  Top 0.406: U1.14 19.11,25.65 18.48,26.29 18.48,33.53 15.07,36.93 J1.2
T2OUT  (via drill 0.61)
  Top 0.406: U1.7 14.03,20.57 13.72,20.26 v13.4,20.26
  Bottom 0.406: v13.4,20.26 4.83,28.83 JP2.1
TX
  Top 0.406: SV1.8 18.54,6.03 18.54,21.27 19.11,21.84 U1.11 LED1.C
TX_2
  Top 0.254: LED3.C 23.88,15.81
  Top 0.406: SV1.13 23.88,3.87 23.88,15.81 23.88,18.03 21.34,20.57 U1.10

### Text on the board
tPlace: Tx | www.orangepi-dmx.org | Rx | GND | Rx | Tx | GND | Tx | Rx | 3V3 | SCL | SDA | Tx | Rx | Rx | Tx
tNames: +